# Altium project LowPowerDataLogger.PrjPcb
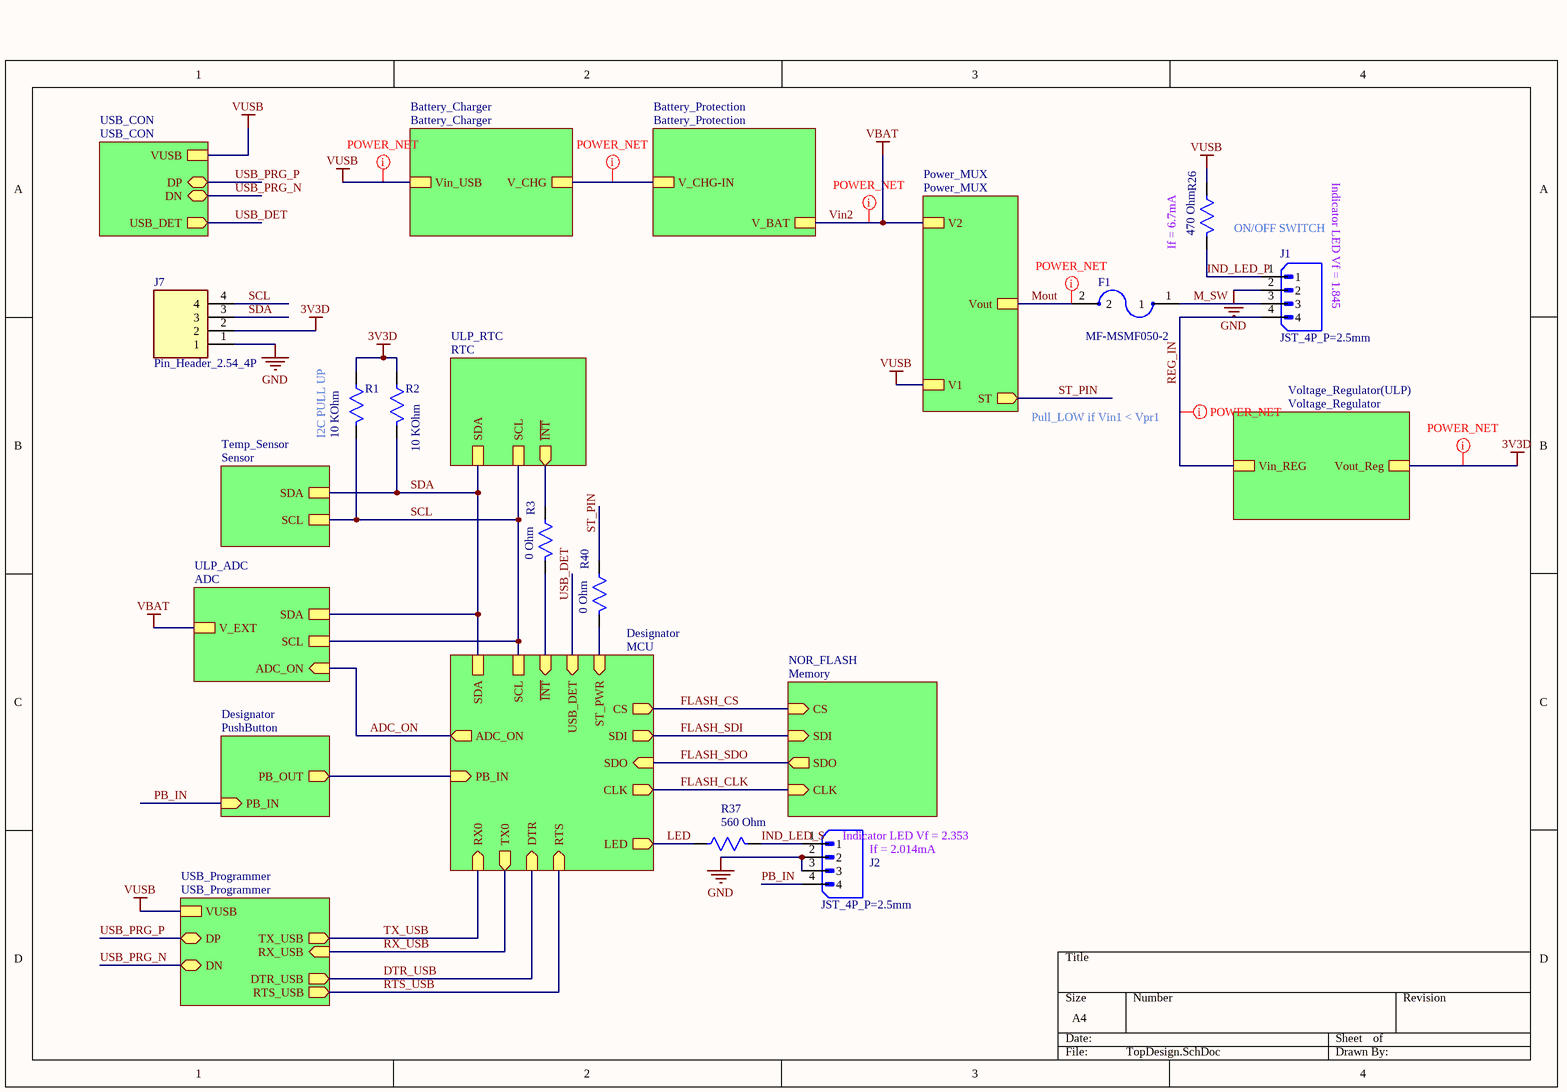
[diagram p0: TopDesign.SchDoc]
13 sheets, 117 parts. Net scope: hierarchical (ports join the sheet entries above them; power ports are global).
Board files: Logger_PCB_6.PcbDoc, Logger_PCB.PcbDoc, Logger_PCB_1.PcbDoc, Logger_PCB_2.PcbDoc, Hole_Cut.PcbDoc
Sheets:
  TopDesign.SchDoc
    Designator = MCU.SchDoc
    Temp_Sensor = Sensor.SchDoc
    ULP_RTC = RTC.SchDoc
    ULP_ADC = ADC.SchDoc
    Designator = PushButton.SchDoc
    NOR_FLASH = Memory.SchDoc
    Battery_Protection = Battery_Protection.SchDoc
    Battery_Charger = Battery_Charger.SchDoc
    Power_MUX = Power_MUX.SchDoc
    Voltage_Regulator(ULP) = Voltage_Regulator.SchDoc
    USB_CON = USB_CON.SchDoc
    USB_Programmer = USB_Programmer.SchDoc

## Sheet TopDesign.SchDoc
size A4; SheetNumber: 1; SheetTotal: 13

### Parts
F1  MF-MSMF050-2  [Fuse_SMD_1812_1A]
J1  JST_4P_P=2.5mm  [JST_4P_Straight_P=2.5mm]
J2  JST_4P_P=2.5mm  [JST_4P_Straight_P=2.5mm]
J7  Pin_Header_2.54_4P  [Pin_Header_2.54_4P]
R1  10 KOhm  [Res_0603]
R2  10 KOhm  [Res_0603]
R3  0 Ohm  [RES_0402]
R26  470 Ohm  [Res_0603]
R37  560 Ohm  [Res_0603]
R40  0 Ohm  [RES_0402]

### Sub-sheets
Battery_Charger = Battery_Charger: Vin_USB, V_CHG
Battery_Protection = Battery_Protection: V_BAT, V_CHG-IN
Designator = MCU: SDA, SCL, PB_IN (in), CS (out), SDI (out), SDO (in), CLK (out), USB_DET (in), ST_PWR (in), TX0 (out), RX0 (in), DTR (in), RTS (in), LED (out), ADC_ON (out), ~{INT} (in)
Designator = PushButton: PB_OUT (out), PB_IN (in)
NOR_FLASH = Memory: CS (in), SDI (in), SDO (out), CLK (in)
Power_MUX = Power_MUX: V2, V1, Vout, ST (out)
Temp_Sensor = Sensor: SDA, SCL
ULP_ADC = ADC: V_EXT, SDA, SCL, ADC_ON (in)
ULP_RTC = RTC: SDA, SCL, ~{INT} (out)
USB_CON = USB_CON: DP (bidir), DN (bidir), USB_DET (out), VUSB
USB_Programmer = USB_Programmer: TX_USB (out), RX_USB (in), DTR_USB (out), DP (bidir), DN (bidir), RTS_USB (out), VUSB
Voltage_Regulator(ULP) = Voltage_Regulator: Vin_REG, Vout_Reg

### Nets
3V3D: J7.2 R1.2 R2.2 ; sheet Voltage_Regulator(ULP)/Vout_Reg
GND: J1.2 J2.2 J2.3 J7.1
Vin2: sheet ULP_ADC/V_EXT, sheet Battery_Protection/V_BAT, sheet Battery_Protection/V_CHG-IN, sheet Battery_Charger/V_CHG, sheet Power_MUX/V2  [also labelled VBAT]
VUSB: R26.2 ; sheet Battery_Charger/Vin_USB, sheet Power_MUX/V1, sheet USB_CON/VUSB, sheet USB_Programmer/VUSB  [project net VBUS]
ADC_ON: sheet Designator/ADC_ON, sheet ULP_ADC/ADC_ON
BTN: sheet Designator/PB_IN, sheet Designator/PB_OUT
DTR_USB: sheet Designator/DTR, sheet USB_Programmer/DTR_USB
FLASH_CLK: sheet Designator/CLK, sheet NOR_FLASH/CLK  [project net CLK]
FLASH_CS: sheet Designator/CS, sheet NOR_FLASH/CS  [project net CS]
FLASH_SDI: sheet Designator/SDI, sheet NOR_FLASH/SDI
FLASH_SDO: sheet Designator/SDO, sheet NOR_FLASH/SDO
IND_LED_P: J1.1 R26.1
IND_LED_S: J2.1 R37.1
LED: R37.2 ; sheet Designator/LED
M_SW: F1.1 J1.3
Mout: F1.2 ; sheet Power_MUX/Vout
PB_IN: J2.4 ; sheet Designator/PB_IN
~{RTC_INT}: R3.1 ; sheet Designator/~{INT}
REG_IN: J1.4 ; sheet Voltage_Regulator(ULP)/Vin_REG
RTC_INT: R3.2 ; sheet ULP_RTC/~{INT}
RTS_USB: sheet Designator/RTS, sheet USB_Programmer/RTS_USB
RX_USB: sheet Designator/TX0, sheet USB_Programmer/RX_USB
SCL: J7.4 R1.1 ; sheet Designator/SCL, sheet Temp_Sensor/SCL, sheet ULP_RTC/SCL, sheet ULP_ADC/SCL
SDA: J7.3 R2.1 ; sheet Designator/SDA, sheet Temp_Sensor/SDA, sheet ULP_RTC/SDA, sheet ULP_ADC/SDA
ST_PIN: R40.2 ; sheet Power_MUX/ST
ST_PWR: R40.1 ; sheet Designator/ST_PWR
TX_USB: sheet Designator/RX0, sheet USB_Programmer/TX_USB
USB_DET: sheet Designator/USB_DET, sheet USB_CON/USB_DET
USB_PRG_N: sheet USB_CON/DN, sheet USB_Programmer/DN
USB_PRG_P: sheet USB_CON/DP, sheet USB_Programmer/DP

### Layout directives
net class POWER_NET: 3V3D, Mout, REG_IN, VBUS, Vin2

### Notes on the sheet
- ON/OFF SWITCH
- (near J1) Indicator LED Vf = 1.845
- (near R26) If = 6.7mA
- (near R1) I2C PULL UP
- Pull_LOW if Vin1 < Vpr1
- (near J2) Indicator LED Vf = 2.353
- (near J2) If = 2.014mA

### Library data of the parts
F1 = MF-MSMF050-2: Polymeric PTC Resettable Fuse 15V 500 mA Ih Surface Mount 1812 (4532 Metric), Concave; MF: Bourns; MP: MF-MSMF050-2; Availability: In Stock; Check_prices: https://www.snapeda.com/parts/MF-MSMF050-2/Bourns+-+J.W.+Miller/view-part/?ref=eda; Price: None; Package: 1812 Bourns; Purchase-URL: https://pricing.snapeda.com/search/part/MF-MSMF050-2/?ref=eda; Value: *; SnapEDA_Link: https://www.snapeda.com/parts/MF-MSMF050-2/Bourns+-+J.W.+Miller/view-part/?ref=snap
J1 J2 = JST_4P_P=2.5mm: Connector Header Through Hole 4 position 0.098 (2.50mm); MF: JST Sales; MP: B4B-XH-A(LF)(SN); SnapEDA_Link: https://www.snapeda.com/parts/B4B-XH-A(LF)(SN)/JST+Sales+America+Inc./view-part/?ref=snap; Package: None; Value: *; Check_prices: https://www.snapeda.com/parts/B4B-XH-A(LF)(SN)/JST+Sales+America+Inc./view-part/?ref=eda
J7 = Pin_Header_2.54_4P: Pin_Header_2.54_2P X 4 MF: 22-28-4050; Manufacturer_Name: Molex; Datasheet Link: http://www.mouser.com/ds/2/276/0022284050_PCB_HEADERS-228092.pdf; Height: 8.38mm; Manufacturer_Part_Number: 22-28-4050; Mouser Part Number: 538-22-28-4050; Mouser Price/Stock: https://www.mouser.co.uk/ProductDetail/Molex/22-28-4050?qs=MuwpYaHj752E1%2FBLq%2Fipmg%3D%3D
R1-R3 R26 R37 R40 = Res smd: SMD Resistor; MP: RC0805FR-07330RL; MF: Yageo; Package: 2012 Rohm Semiconductor; Value: *; SnapEDA_Link: https://www.snapeda.com/parts/RC0805FR-07330RL/Yageo/view-part/106115/?ref=snap; Price: None; Availability: Unavailable

## Sheet MCU.SchDoc
size A4; SheetNumber: 2; SheetTotal: 13
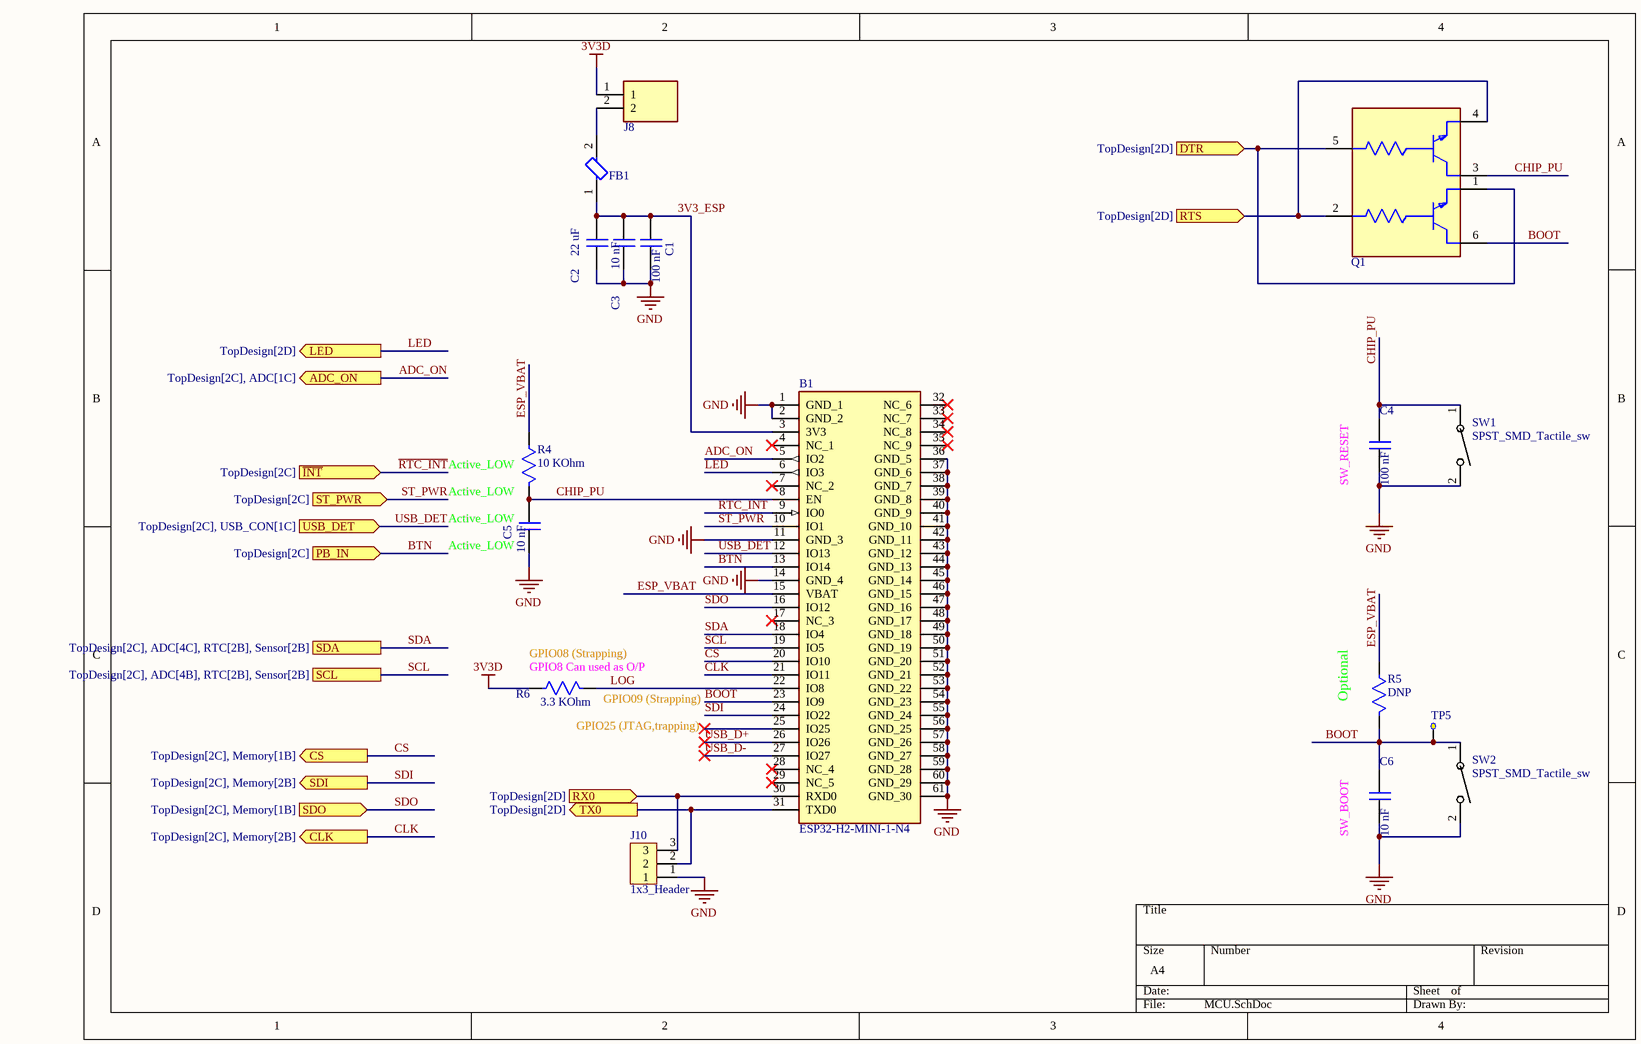
[diagram p1: MCU.SchDoc]

### Parts
B1  ESP32-H2-MINI-1-N4  [ESP32-H2-MINI-1-NX]
C1  100 nF  [CAP_0603]
C2  22 uF  [CAP_0603]
C3  10 nF  [CAP_0603]
C4  100 nF  [CAP_0603]
C5  10 nF  [CAP_0603]
C6  10 nF  [CAP_0603]
FB1  BLM18KG601SN1D  [FBead_Murata_BLM18KG601SN1D]  (value not drawn)
J8  Pin_Header_2.54_2P  [Pin_Header_2.54_2P]  (value not drawn)
J10  1x3_Header  [1x3_Header]
Q1  UMH3NTN-(Dual Transistor With Base Res)  [UMH3NTN-(Dual Transistor With Base Res-SOT-363)]  (value not drawn)
R4  10 KOhm  [Res_0603]
R5  DNP  [Res_0603]
R6  3.3 KOhm  [Res_0603]
SW1  SPST_SMD_Tactile_sw  [SPST_SMD_6mm]
SW2  SPST_SMD_Tactile_sw  [SPST_SMD_6mm]
TP5  boot  [Test_Point]  (value not drawn)

### Ports
ADC_ON (out, see TopDesign[2C], ADC[1C]), CLK (out, see TopDesign[2C], Memory[2B]), CS (out, see TopDesign[2C], Memory[1B]), DTR (in, see TopDesign[2D]), LED (out, see TopDesign[2D]), PB_IN (in, see TopDesign[2C]), RTS (in, see TopDesign[2D]), RX0 (in, see TopDesign[2D]), SCL (see TopDesign[2C], ADC[4B], RTC[2B], Sensor[2B]), SDA (see TopDesign[2C], ADC[4C], RTC[2B], Sensor[2B]), SDI (out, see TopDesign[2C], Memory[2B]), SDO (in, see TopDesign[2C], Memory[1B]), ST_PWR (in, see TopDesign[2C]), TX0 (out, see TopDesign[2D]), USB_DET (in, see TopDesign[2C], USB_CON[1C]), ~{INT} (in, see TopDesign[2C])

### Nets
3V3D: J8.1 R6.2
GND: B1.1(GND_1) B1.2(GND_2) B1.11(GND_3) B1.14(GND_4) B1.36(GND_5) B1.37(GND_6) B1.38(GND_7) B1.39(GND_8) B1.40(GND_9) B1.41(GND_10) B1.42(GND_11) B1.43(GND_12) B1.44(GND_13) B1.45(GND_14) B1.46(GND_15) B1.47(GND_16) B1.48(GND_17) B1.49(GND_18) B1.50(GND_19) B1.51(GND_20) B1.52(GND_21) B1.53(GND_22) B1.54(GND_23) B1.55(GND_24) B1.56(GND_25) B1.57(GND_26) B1.58(GND_27) B1.59(GND_28) B1.60(GND_29) B1.61(GND_30) C1.1 C2.1 C3.1 C4.1 C5.1 C6.1 J10.1 SW1.2 SW2.2
3V3_ESP: B1.3(3V3) C1.2 C2.2 C3.2 FB1.1
ADC_ON: B1.5(IO2) ; port ADC_ON
BOOT: B1.23(IO9) C6.2 Q1.6(C) R5.1 SW2.1 TP5.TP?(Ref_Point)
BTN: B1.13(IO14) ; port PB_IN
CHIP_PU: B1.8(EN) C4.2 C5.2 Q1.3(C) R4.1 SW1.1
CLK: B1.21(IO11) ; port CLK
CS: B1.20(IO10) ; port CS
DTR_USB: Q1.1(E) Q1.5(B) ; port DTR
ESP_VBAT: B1.15(VBAT) R4.2 R5.2
LED: B1.6(IO3) ; port LED
LOG: B1.22(IO8) R6.1
~{RTC_INT}: B1.9(IO0) ; port ~{INT}
RTS_USB: Q1.2(B) Q1.4(E) ; port RTS
RX_USB: B1.31(TXD0) J10.2 ; port TX0
SCL: B1.19(IO5) ; port SCL
SDA: B1.18(IO4) ; port SDA
SDI: B1.24(IO22) ; port SDI  [project net FLASH_SDI]
SDO: B1.16(IO12) ; port SDO  [project net FLASH_SDO]
ST_PWR: B1.10(IO1) ; port ST_PWR
TX_USB: B1.30(RXD0) J10.3 ; port RX0
USB_D+: B1.26(IO26)
USB_D-: B1.27(IO27)
USB_DET: B1.12(IO13) ; port USB_DET
NetFB1_2: FB1.2 J8.2

Not connected (* = marked no-connect by the designer): B1 4(NC_1)* 7(NC_2)* 17(NC_3)* 25(IO25)* 28(NC_4)* 29(NC_5)* 32(NC_6)* 33(NC_7)* 34(NC_8)* 35(NC_9)*

### Notes on the sheet
- Active_LOW
- (near R4) Active_LOW
- (near C4) SW_RESET
- (near C5) Active_LOW
- (near R6) GPIO08 (Strapping)
- (near R6) GPIO8 Can used as O/P
- (near R6) GPIO25 (JTAG,trapping)
- (near R6) GPIO09 (Strapping)
- (near R5) Optional
- (near C6) SW_BOOT

### Library data of the parts
B1 = ESP32-H2-MINI-1-XX: Multiprotocol Modules ENGINEERING SAMPLE Bluetooth Low Energy and IEEE 802.15.4  module with ESP32-H2 chip; Manufacturer_Name: Espressif Systems; Geometry.Height: 2.55mm; Manufacturer_Part_Number: ESP32-H2-MINI-1-N4; Datasheet Link: https://www.espressif.com/sites/default/files/documentation/esp32-h2-mini-1_mini-1u_datasheet_en.pdf; LCSC: N-C18203134/U-C22470215
C1-C6 = Cap SMD: Cap SMD.
J8 = Pin_Header_2.54_2P: Pin_Header_2.54_2P_Straight; Manufacturer_Name: Wurth Elektronik; Manufacturer_Part_Number: 61300211121; Geometry.Height: 8.54mm; Datasheet Link: https://componentsearchengine.com/Datasheets/2/61300211121.pdf; LCSC: C492401
Q1 = UMH3NTN-(Dual Transistor With Base Res): UMH3NTN-(Dual Transistor With Base Res = 4.7K) , 100@1mA,5V 150mW 100mA 50V SOT-363 Digital Transistors ROHS; MPN: ROHM; MFPN: UMH3NTN; Datasheet: https://www.lcsc.com/datasheet/C123008.pdf; LCSC: C123008
R4-R6 = Res smd: as R1 on sheet TopDesign; Package: 2012 Rohm Semiconductor; Value: *; SnapEDA_Link: https://www.snapeda.com/parts/RC0805FR-07330RL/Yageo/view-part/106115/?ref=snap; Price: None; Availability: Unavailable
SW1 SW2 = SPST_SMD_Tactile_sw: SPST SMD Tactile Switches Rectangle button Brick nogging; Mfr_Name: XKB Connectivity
TP5 = Test_Point

## Sheet Sensor.SchDoc
size A4; SheetNumber: 6; SheetTotal: 14
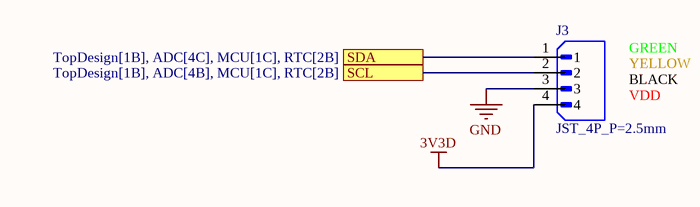
[diagram p2: Sensor.SchDoc]

### Parts
J3  JST_4P_P=2.5mm  [JST_4P_Straight_P=2.5mm]

### Ports
SCL (see TopDesign[1B], ADC[4B], MCU[1C], RTC[2B]), SDA (see TopDesign[1B], ADC[4C], MCU[1C], RTC[2B])

### Nets
3V3D: J3.4
GND: J3.3
SCL: J3.2 ; port SCL
SDA: J3.1 ; port SDA

### Notes on the sheet
- GREEN
- YELLOW
- BLACK
- VDD

### Library data of the parts
J3 = JST_4P_P=2.5mm: as J1 on sheet TopDesign; SnapEDA_Link: https://www.snapeda.com/parts/B4B-XH-A(LF)(SN)/JST+Sales+America+Inc./view-part/?ref=snap; Package: None; Value: *; Check_prices: https://www.snapeda.com/parts/B4B-XH-A(LF)(SN)/JST+Sales+America+Inc./view-part/?ref=eda

## Sheet RTC.SchDoc
size A4; SheetNumber: 8; SheetTotal: 13
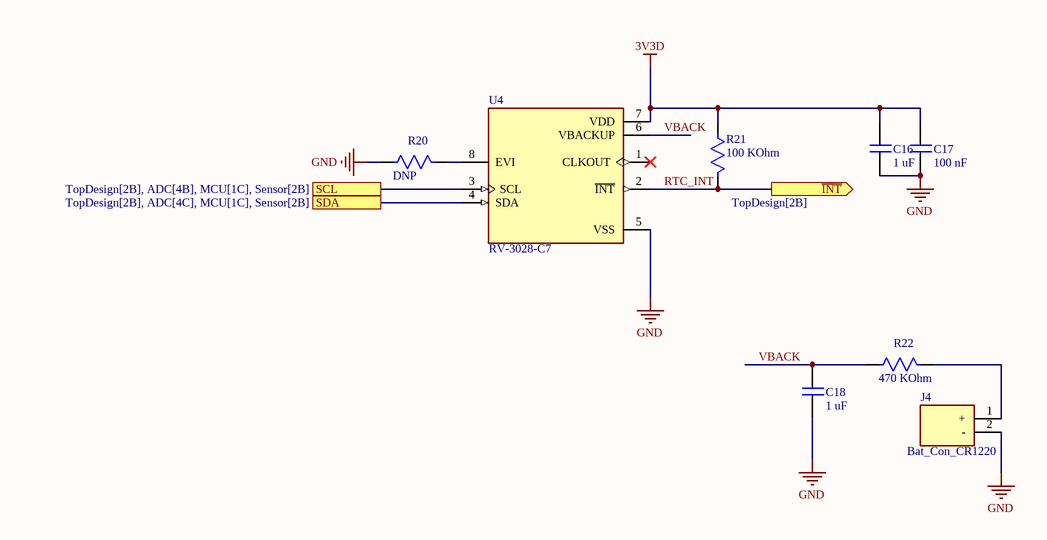
[diagram p3: RTC.SchDoc]

### Parts
C16  1 uF  [CAP_0603]
C17  100 nF  [CAP_0603]
C18  1 uF  [CAP_0603]
J4  Bat_Con_CR1220  [Bat_Con_CR1220]
R20  DNP  [RES_0402]
R21  100 KOhm  [Res_0603]
R22  470 KOhm  [Res_0603]
U4  RV-3028-C7  [IC_RV-3028-C7]

### Ports
SCL (see TopDesign[2B], ADC[4B], MCU[1C], Sensor[2B]), SDA (see TopDesign[2B], ADC[4C], MCU[1C], Sensor[2B]), ~{INT} (out, see TopDesign[2B])

### Nets
3V3D: C16.2 C17.2 R21.2 U4.7(VDD)
GND: C16.1 C17.1 C18.1 J4.2(-) R20.2 U4.5(VSS)
RTC_INT: R21.1 U4.2(~{INT}) ; port ~{INT}
SCL: U4.3(SCL) ; port SCL
SDA: U4.4(SDA) ; port SDA
VBACK: C18.2 R22.2 U4.6(VBACKUP)
NetJ4_1: J4.1(+) R22.1
NetR20_1: R20.1 U4.8(EVI)

Not connected (* = marked no-connect by the designer): U4 1(CLKOUT)*

### Library data of the parts
C16-C18 = Cap SMD: Cap SMD.
J4 = Bat_Con_CR1220: Connector; Manufacturer_Name: Harwin; Manufacturer_Part_Number: S8411-45R; Datasheet Link: https://cdn.harwin.com/pdfs/S8411R.pdf; Mouser Part Number: 855-S8411-45R; Mouser Price/Stock: https://www.mouser.co.uk/ProductDetail/Harwin/S8411-45R?qs=Qom7kyPojXY6B0JhnWxDgQ%3D%3D; LCSC: C969906
R20-R22 = Res smd: as R1 on sheet TopDesign; Package: 2012 Rohm Semiconductor; Value: *; SnapEDA_Link: https://www.snapeda.com/parts/RC0805FR-07330RL/Yageo/view-part/106115/?ref=snap; Price: None; Availability: Unavailable
U4 = RV-3028-C7: Real Time Clock (RTC) IC Clock/Calendar 2B, 43B IÂ²C, 2-Wire Serial 8-WCDFN; MF: Micro Crystal; MFPN: RV-3028-C7 32.768KHZ 1PPM-TA-QA; SnapEDA_Link: https://www.snapeda.com/parts/RV-3028-C7%2032.768KHZ%201PPM-TA-QA/Micro+Crystal/view-part/?ref=snap; Package: SMD3215-8P; LCSC: C3304278

## Sheet ADC.SchDoc
size A4; SheetNumber: 5; SheetTotal: 14
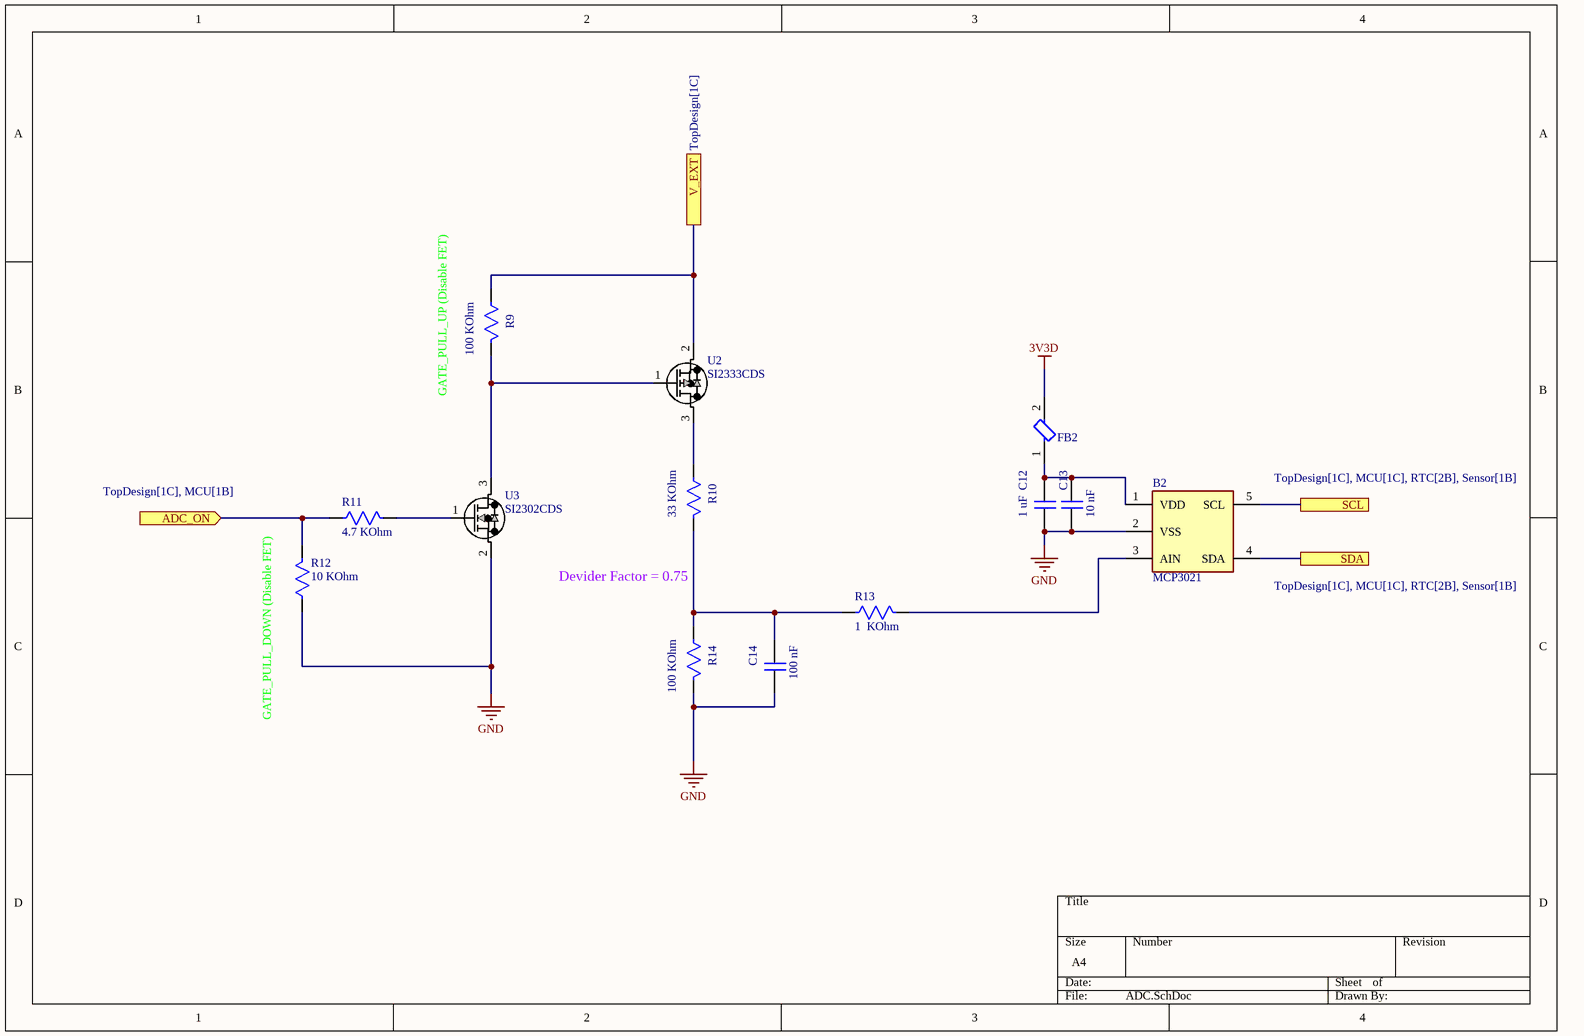
[diagram p4: ADC.SchDoc]

### Parts
B2  MCP3021  [MCP3021A5T-E_OT]
C12  1 uF  [CAP_0603]
C13  10 nF  [CAP_0603]
C14  100 nF  [CAP_0603]
FB2  BLM18KG601SN1D  [FBead_Murata_BLM18KG601SN1D]  (value not drawn)
R9  100 KOhm  [Res_0603]
R10  33 KOhm  [Res_0603]
R11  4.7 KOhm  [Res_0603]
R12  10 KOhm  [Res_0603]
R13  1  KOhm  [Res_0603]
R14  100 KOhm  [Res_0603]
U2  SI2333CDS  [SOT-23]
U3  SI2302CDS  [SOT-23]

### Ports
ADC_ON (in, see TopDesign[1C], MCU[1B]), SCL (see TopDesign[1C], MCU[1C], RTC[2B], Sensor[1B]), SDA (see TopDesign[1C], MCU[1C], RTC[2B], Sensor[1B]), V_EXT (see TopDesign[1C])

### Nets
3V3D: FB2.2
GND: B2.2(VSS) C12.1 C13.1 C14.1 R12.2 R14.1 U3.2(S)
Vin2: R9.2 U2.2(S) ; port V_EXT
ADC_ON: R11.2 R12.1 ; port ADC_ON
SCL: B2.5(SCL) ; port SCL
SDA: B2.4(SDA) ; port SDA
NetB2_1: B2.1(VDD) C12.2 C13.2 FB2.1
NetB2_3: B2.3(AIN) R13.1
NetC14_2: C14.2 R10.1 R13.2 R14.2
NetR9_1: R9.1 U2.1(G) U3.3(D)
NetR10_2: R10.2 U2.3(D)
NetR11_1: R11.1 U3.1(G)

### Notes on the sheet
- (near R9) GATE_PULL_UP (Disable FET)
- Devider Factor = 0.75
- (near R12) GATE_PULL_DOWN (Disable FET)

### Library data of the parts
B2 = MCP3021A5T-E_OT: ADC - ,SAR, Single Ended ,10-bit ,I2C , 250uA-Active ,1uA -Standby; Manufacturer_Name: Microchip; Manufacturer_Part_Number: MCP3021A5T-E/OT; Geometry.Height: 1.45mm; Foot Print: SOT-23-5; Datasheet Link: https://lcsc.componentsearchengine.com/Datasheets/2/MCP3021A5T-E_OT.pdf; LCSC: C128576
C12-C14 = Cap SMD: Cap SMD.
R9-R14 = Res smd: as R1 on sheet TopDesign; Package: 2012 Rohm Semiconductor; Value: *; SnapEDA_Link: https://www.snapeda.com/parts/RC0805FR-07330RL/Yageo/view-part/106115/?ref=snap; Price: None; Availability: Unavailable
U2 = SI2333CDS: P-Channel  MOSFET Vds=12V ,RDS(on)=35mOhm .  at VGS = 4.5 V; Mfr_Name: Vishay; Type: P-MOSFET; LCSC: C48179
U3 = SI2302CDS: N-Channel  MOSFET Vds=20V ,RDS(on)=57mOhm .  at VGS = 4.5 V; Mfr_Name: Vishay; Type: N-MOSFET; LCSC: C10488

## Sheet PushButton.SchDoc
size A4; SheetNumber: 3; SheetTotal: 14
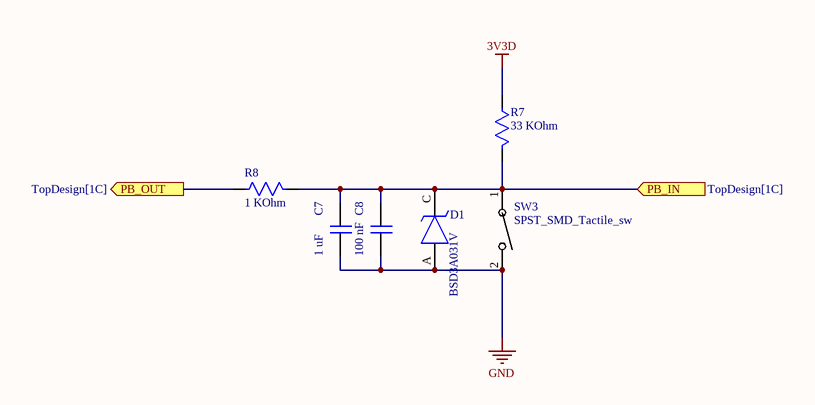
[diagram p5: PushButton.SchDoc]

### Parts
C7  1 uF  [CAP_0603]
C8  100 nF  [CAP_0603]
D1  BSD3A031V  [MCC_SOD-323_IPC_A]
R7  33 KOhm  [Res_0603]
R8  1 KOhm  [Res_0603]
SW3  SPST_SMD_Tactile_sw  [SPST_SMD_6mm]

### Ports
PB_IN (in, see TopDesign[1C]), PB_OUT (out, see TopDesign[1C])

### Nets
3V3D: R7.2
GND: C7.1 C8.1 D1.A SW3.2
BTN: R8.2 ; port PB_OUT
PB_IN: C7.2 C8.2 D1.C R7.1 R8.1 SW3.1 ; port PB_IN

### Library data of the parts
C7 C8 = Cap SMD: Cap SMD.
D1 = TVS_Diode_Single: TVS Diode (Uni-directional); Manufacturer_Name: LITTELFUSE; Manufacturer_Part_Number: SMAJ14A; Datasheet Link: https://componentsearchengine.com/Datasheets/2/SMAJ14A.pdf; Height: 2.29mm; Mouser Part Number: 576-SMAJ14A; Mouser Price/Stock: https://www.mouser.co.uk/ProductDetail/Littelfuse/SMAJ14A?qs=HR2RnyOI4E4Xmn1pka9YNw%3D%3D; Arrow Part Number: SMAJ14A; Arrow Price/Stock: https://www.arrow.com/en/products/smaj14a/littelfuse?region=nac
R7 R8 = Res smd: as R1 on sheet TopDesign; Package: 2012 Rohm Semiconductor; Value: *; SnapEDA_Link: https://www.snapeda.com/parts/RC0805FR-07330RL/Yageo/view-part/106115/?ref=snap; Price: None; Availability: Unavailable
SW3 = SPST_SMD_Tactile_sw: as SW1 on sheet MCU

## Sheet Memory.SchDoc
size A4; SheetNumber: 7; SheetTotal: 13
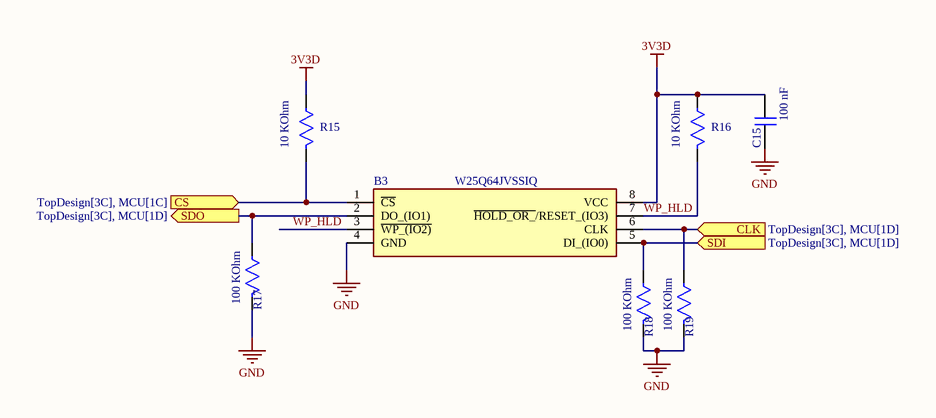
[diagram p6: Memory.SchDoc]

### Parts
B3  W25Q64JVSSIQ  [W25Q64JVSSIQ]
C15  100 nF  [CAP_0603]
R15  10 KOhm  [Res_0603]
R16  10 KOhm  [Res_0603]
R17  100 KOhm  [Res_0603]
R18  100 KOhm  [Res_0603]
R19  100 KOhm  [Res_0603]

### Ports
CLK (in, see TopDesign[3C], MCU[1D]), CS (in, see TopDesign[3C], MCU[1C]), SDI (in, see TopDesign[3C], MCU[1D]), SDO (out, see TopDesign[3C], MCU[1D])

### Nets
3V3D: B3.8(VCC) C15.2 R15.2 R16.2
GND: B3.4(GND) C15.1 R17.1 R18.1 R19.1
CLK: B3.6(CLK) R19.2 ; port CLK
CS: B3.1(~{CS}) R15.1 ; port CS
FLASH_SDI: B3.5(DI_(IO0)) R18.2 ; port SDI
FLASH_SDO: B3.2(DO_(IO1)) R17.2 ; port SDO
WP_HLD: B3.3(~{WP_(IO2)}) B3.7(~{HOLD_OR_}/RESET_(IO3)) R16.1

### Library data of the parts
B3 = W25Q64JVSSIQ: 64Mb Serial NOR Flash 133MHz SOP864Mbit 2.7V~3.6V 133MHz SPI SOIC-8-208mil Memory (ICs) ROHS; Manufacturer_Name: Winbond; Geometry.Height: 2.16mm; Manufacturer_Part_Number: W25Q64JVSSIQ; Datasheet Link: https://www.winbond.com/hq/search-resource-file.jsp?partNo=W25Q64JVSSIQ&type=datasheet; LCSC: C179171
C15 = Cap SMD: Cap SMD.
R15-R19 = Res smd: as R1 on sheet TopDesign; Package: 2012 Rohm Semiconductor; Value: *; SnapEDA_Link: https://www.snapeda.com/parts/RC0805FR-07330RL/Yageo/view-part/106115/?ref=snap; Price: None; Availability: Unavailable

## Sheet Battery_Protection.SchDoc
size A4; SheetNumber: 11; SheetTotal: 13
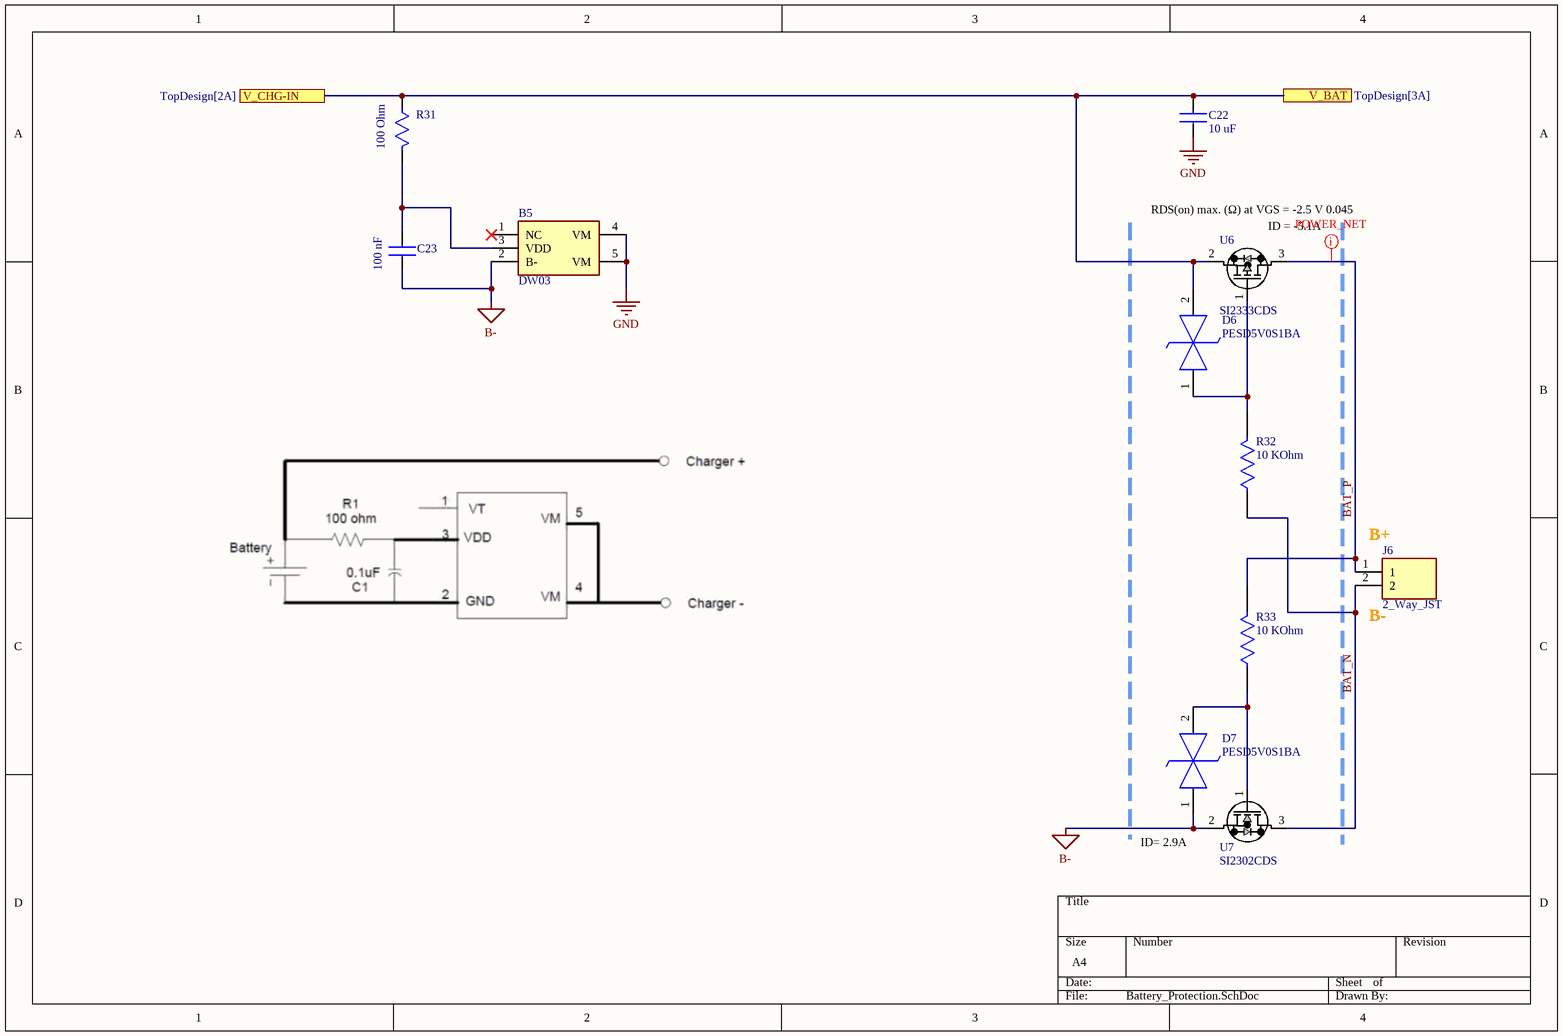
[diagram p7: Battery_Protection.SchDoc]

### Parts
B5  DW03  [DW03]
C22  10 uF  [CAP_0603]
C23  100 nF  [CAP_0603]
D6  PESD5V0S1BA  [TVS_SOD-323]
D7  PESD5V0S1BA  [TVS_SOD-323]
J6  2_Way_JST  [2_Way_JST_Connector]
R31  100 Ohm  [Res_0603]
R32  10 KOhm  [Res_0603]
R33  10 KOhm  [Res_0603]
U6  SI2333CDS  [SOT-23]
U7  SI2302CDS  [SOT-23]

### Ports
V_BAT (see TopDesign[3A]), V_CHG-IN (see TopDesign[2A])

### Nets
B-: B5.2(B-) C23.1 D7.1(K1) U7.2(S)
GND: B5.4(VM) B5.5(VM) C22.1
Vin2: C22.2 D6.2(K2) R31.2 U6.2(S) ; port V_BAT, port V_CHG-IN
BAT_N: J6.2 R32.1 U7.3(D)
BAT_P: J6.1 R33.2 U6.3(D)
NetB5_3: B5.3(VDD) C23.2 R31.1
NetD6_1: D6.1(K1) R32.2 U6.1(G)
NetD7_2: D7.2(K2) R33.1 U7.1(G)

Not connected (* = marked no-connect by the designer): B5 1(NC)*

### Layout directives
mark named POWER_NET: BAT_P

### Notes on the sheet
- (near U6) RDS(on) max. (Ω) at VGS = -2.5 V 0.045
- (near U6) ID = -5.1A
- (near J6) B+
- (near J6) B-
- (near U7) ID= 2.9A

### Library data of the parts
B5 = DW03: 2K 256X8 1.8V Ser.EEPROM,24AA02E48T-I/OT; Manufacturer_Name: HXY MOSFET; Geometry.Height: 1.45mm; Manufacturer_Part_Number: DW03; Datasheet Link: https://www.lcsc.com/datasheet/C18198382.pdf; LCSC: C18198382
C22 C23 = Cap_SMD_New: Cap Ceramic 1uF 10V X5R 10% Pad SMD 0402 85C T/R; Manufacturer_Name: SAMSUNG; Manufacturer_Part_Number: CL05A105KP5NNNC; Geometry.Height: 0.55mm; Mouser Part Number: 187-CL05A105KP5NNNC; Mouser Price/Stock: https://www.mouser.co.uk/ProductDetail/Samsung-Electro-Mechanics/CL05A105KP5NNNC?qs=X6jEic%2FHinBsUeNeR9HD7w%3D%3D; Arrow Part Number: CL05A105KP5NNNC; Arrow Price/Stock: https://www.arrow.com/en/products/cl05a105kp5nnnc/samsung-electro-mechanics?region=nac; Datasheet Link: https://www.arrow.com/en/products/cl05a105kp5nnnc/samsung-electro-mechanics
D6 D7 = TVS_Diode_Bi-Direcctional: Diode ESD (Bi-directional); Manufacturer_Name: Nexperia; Manufacturer_Part_Number: PESD12VL1BA,115; Datasheet Link: https://assets.nexperia.com/documents/data-sheet/PESDXL1BA_SER.pdf; Height: 1.1mm; Mouser Part Number: 771-PESD12VL1BA-T/R; Mouser Price/Stock: https://www.mouser.co.uk/ProductDetail/Nexperia/PESD12VL1BA115?qs=LOCUfHb8d9tizc9iojOZUw%3D%3D; Arrow Part Number: PESD12VL1BA,115; Arrow Price/Stock: https://www.arrow.com/en/products/pesd12vl1ba115/nexperia?region=europe
J6 = 2_Way_JST_Connector: Connector Header Through Hole 2 position 0.098 (2.50mm); MF: JST Sales; MP: B2B-XH-A(LF)(SN); Value: *; Check_prices: https://www.snapeda.com/parts/B2B-XH-A(LF)(SN)/JST%20Sales%20America%20Inc./view-part/492310/?ref=eda; Price: None; Package: None; Availability: In Stock; SnapEDA_Link: https://www.snapeda.com/parts/B2B-XH-A(LF)(SN)/JST%20Sales%20America%20Inc./view-part/492310/?ref=snap
R31-R33 = Res smd: as R1 on sheet TopDesign; Package: 2012 Rohm Semiconductor; Value: *; SnapEDA_Link: https://www.snapeda.com/parts/RC0805FR-07330RL/Yageo/view-part/106115/?ref=snap; Price: None; Availability: Unavailable
U6 = SI2333CDS: as U2 on sheet ADC; Type: P-MOSFET; LCSC: C48179
U7 = SI2302CDS: as U3 on sheet ADC; Type: N-MOSFET; LCSC: C10488

## Sheet Battery_Charger.SchDoc
size A4; SheetNumber: 10; SheetTotal: 13
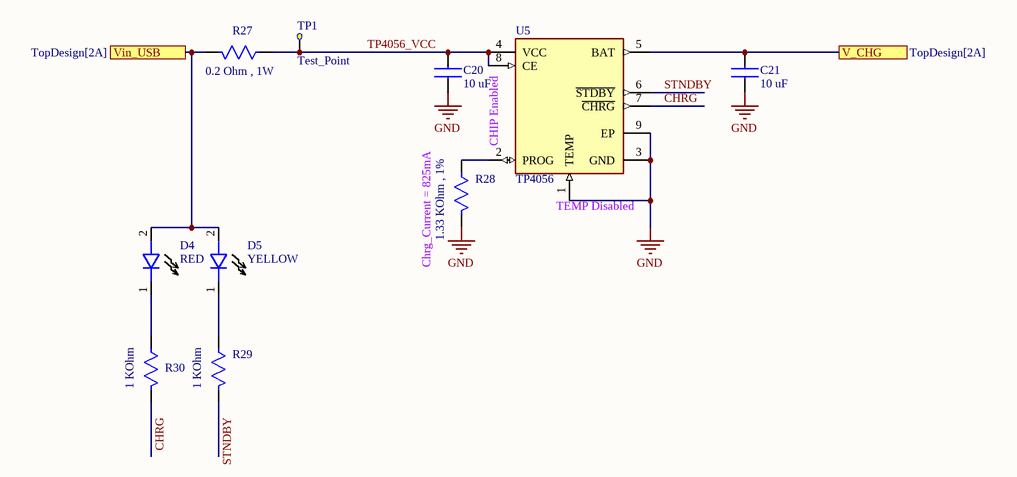
[diagram p8: Battery_Charger.SchDoc]

### Parts
C20  10 uF  [CAP_0603]
C21  10 uF  [CAP_0603]
D4  RED  [LED SMD 0603]
D5  YELLOW  [LED SMD 0603]
R27  0.2 Ohm , 1W  [RES_2512]
R28  1.33 KOhm , 1%  [Res_0603]
R29  1 KOhm  [Res_0603]
R30  1 KOhm  [Res_0603]
TP1  Test_Point  [Test_Point]
U5  TP4056  [TP4056-SOP-8-EP]

### Ports
V_CHG (see TopDesign[2A]), Vin_USB (see TopDesign[2A])

### Nets
GND: C20.1 C21.1 R28.1 U5.1(TEMP) U5.3(GND) U5.9(EP)
VBUS: D4.2 D5.2 R27.1 ; port Vin_USB
Vin2: C21.2 U5.5(BAT) ; port V_CHG
CHRG: R30.1 U5.7(~{CHRG})
STNDBY: R29.1 U5.6(~{STDBY})
TP4056_VCC: C20.2 R27.2 TP1.TP?(Ref_Point) U5.4(VCC) U5.8(CE)
NetD4_1: D4.1 R30.2
NetD5_1: D5.1 R29.2
NetR28_2: R28.2 U5.2(PROG)

### Notes on the sheet
- (near U5) CHIP Enabled
- (near U5) TEMP Disabled
- (near R28) Chrg_Current = 825mA

### Library data of the parts
C20 C21 = Cap_SMD_New: as C22 on sheet Battery_Protection; Mouser Part Number: 187-CL05A105KP5NNNC; Mouser Price/Stock: https://www.mouser.co.uk/ProductDetail/Samsung-Electro-Mechanics/CL05A105KP5NNNC?qs=X6jEic%2FHinBsUeNeR9HD7w%3D%3D; Arrow Part Number: CL05A105KP5NNNC; Arrow Price/Stock: https://www.arrow.com/en/products/cl05a105kp5nnnc/samsung-electro-mechanics?region=nac; Datasheet Link: https://www.arrow.com/en/products/cl05a105kp5nnnc/samsung-electro-mechanics
D4 D5 = LED SMD: SMD LED
R27-R30 = Res smd: as R1 on sheet TopDesign; Package: 2012 Rohm Semiconductor; Value: *; SnapEDA_Link: https://www.snapeda.com/parts/RC0805FR-07330RL/Yageo/view-part/106115/?ref=snap; Price: None; Availability: Unavailable
U5 = TP4056: Complete single cell Li-Ion battery with a constant current / constant voltage linear charger(SOP 8); MFPN: TP4056; Datasheet: https://dlnmh9ip6v2uc.cloudfront.net/datasheets/Prototyping/TP4056.pdf; LCSC: C7473158

## Sheet Power_MUX.SchDoc
size A4; SheetNumber: 12; SheetTotal: 13
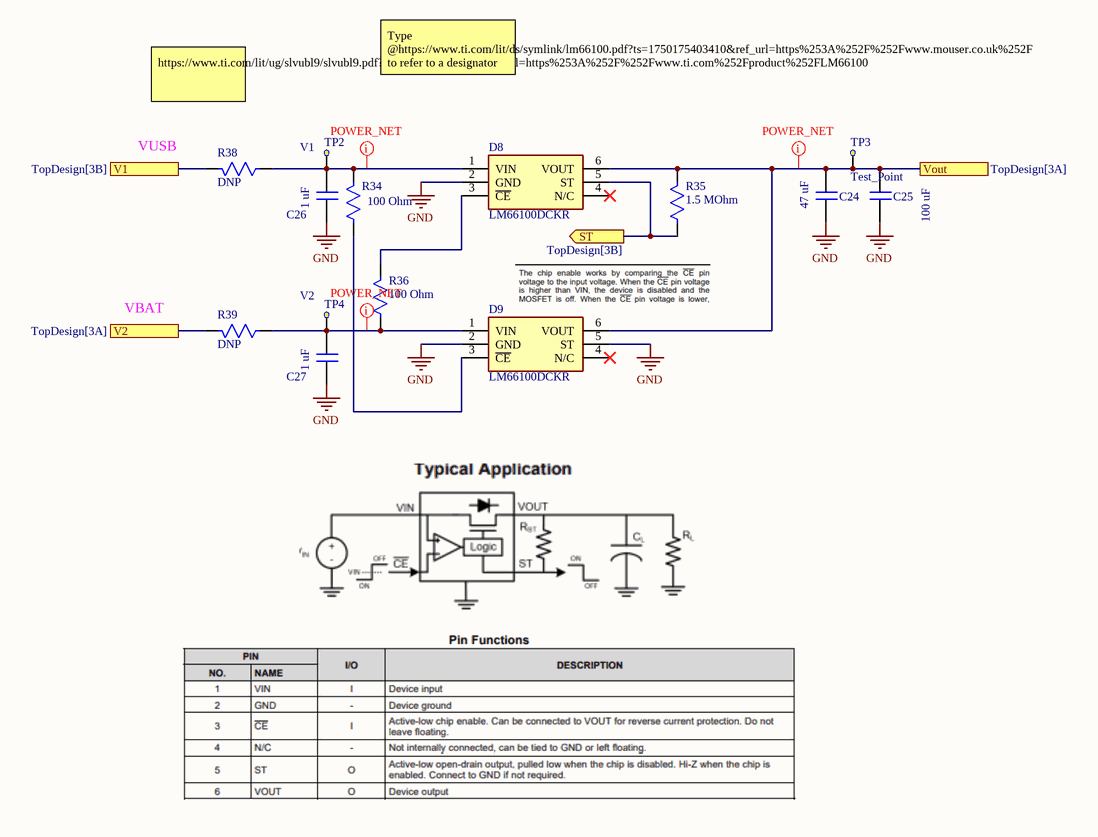
[diagram p9: Power_MUX.SchDoc]

### Parts
C24  47 uF  [CAP SMD 1206]
C25  100 uF  [CAP SMD 1206]
C26  1 uF  [CAP_0603]
C27  1 uF  [CAP_0603]
D8  LM66100DCKR  [LM66100DCKR]
D9  LM66100DCKR  [LM66100DCKR]
R34  100 Ohm  [Res_0603]
R35  1.5 MOhm  [Res_0603]
R36  100 Ohm  [Res_0603]
R38  DNP  [RES_0402]
R39  DNP  [RES_0402]
TP2  V1  [Test_Point]
TP3  Test_Point  [Test_Point]
TP4  V2  [Test_Point]

### Ports
ST (out, see TopDesign[3B]), V1 (see TopDesign[3B]), V2 (see TopDesign[3A]), Vout (see TopDesign[3A])

### Nets
GND: C24.1 C25.1 C26.1 C27.1 D8.2(GND) D9.2(GND) D9.5(ST)
VBUS: R38.1 ; port V1
Vin2: R39.1 ; port V2
Mout: C24.2 C25.2 D8.6(VOUT) D9.6(VOUT) R35.1 TP3.TP?(Ref_Point) ; port Vout
ST_PIN: D8.5(ST) R35.2 ; port ST
NetC26_2: C26.2 D8.1(VIN) R34.1 R38.2 TP2.TP?(Ref_Point)
NetC27_2: C27.2 D9.1(VIN) R36.2 R39.2 TP4.TP?(Ref_Point)
NetD8_3: D8.3(~{CE}) R36.1
NetD9_3: D9.3(~{CE}) R34.2

Not connected (* = marked no-connect by the designer): D8 4(N/C)*; D9 4(N/C)*

### Layout directives
mark named POWER_NET: Mout, NetC26_2, NetC27_2

### Notes on the sheet
- https://www.ti.com/lit/ug/slvubl9/slvubl9.pdf?ts=1750260250038&ref_url=https%253A%252F%252Fwww.ti.com%252Fproduct%252FLM66100
- Type @https://www.ti.com/lit/ds/symlink/lm66100.pdf?ts=1750175403410&ref_url=https%253A%252F%252Fwww.mouser.co.uk%252F to refer to a designator or a net
- (near R38) VUSB
- VBAT

### Library data of the parts
C24-C27 = Cap SMD: Cap SMD.
D8 D9 = LM66100DCKR: +/-6-V, Low IQ ideal diode with input polarity protection; Manufacturer_Name: Texas Instruments; Geometry.Height: 1.1mm; Manufacturer_Part_Number: LM66100DCKR; Datasheet Link: http://www.ti.com/lit/gpn/LM66100; LCSC: C2869734; FootPrint: SC-70-6
R34-R36 R38 R39 = Res smd: as R1 on sheet TopDesign; Package: 2012 Rohm Semiconductor; Value: *; SnapEDA_Link: https://www.snapeda.com/parts/RC0805FR-07330RL/Yageo/view-part/106115/?ref=snap; Price: None; Availability: Unavailable
TP2 TP4 = Test_Point

## Sheet Voltage_Regulator.SchDoc
size A4; SheetNumber: 14; SheetTotal: 14
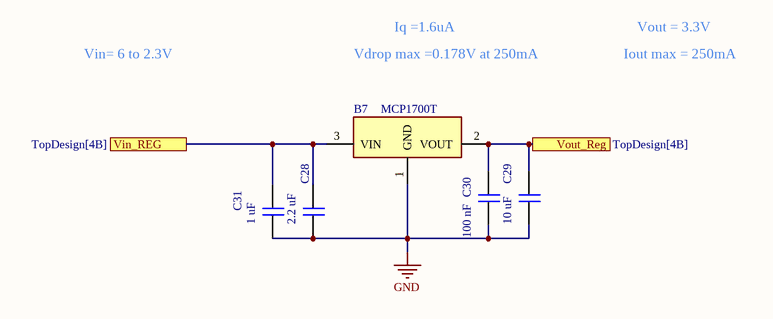
[diagram p10: Voltage_Regulator.SchDoc]

### Parts
B7  MCP1700T  [MCP1700T-SOT23]
C28  2.2 uF  [CAP_0603]
C29  10 uF  [CAP_0603]
C30  100 nF  [CAP_0603]
C31  1 uF  [CAP_0603]

### Ports
Vin_REG (see TopDesign[4B]), Vout_Reg (see TopDesign[4B])

### Nets
3V3D: B7.2(VOUT) C29.2 C30.2 ; port Vout_Reg
GND: B7.1(GND) C28.1 C29.1 C30.1 C31.1
REG_IN: B7.3(VIN) C28.2 C31.2 ; port Vin_REG

### Notes on the sheet
- Vin= 6 to 2.3V
- Vdrop max =0.178V at 250mA
- Iq =1.6uA
- Iout max = 250mA
- Vout = 3.3V

### Library data of the parts
B7 = MCP1700T-SOT23: LDO voltage regulator 250mA Isupply 1.6uA; MPN: Microchip; MFPN: MCP1700T-3302E/TT; Geometry.Height: 1.12mm; Datasheet Link: https://datasheet.datasheetarchive.com/originals/distributors/SFDatasheet-4/sf-00090030.pdf; LCSC: C39051; Iq: 1.6 uA
C28-C31 = Cap SMD: Cap SMD.

## Sheet USB_CON.SchDoc
size A4; SheetNumber: 9; SheetTotal: 13
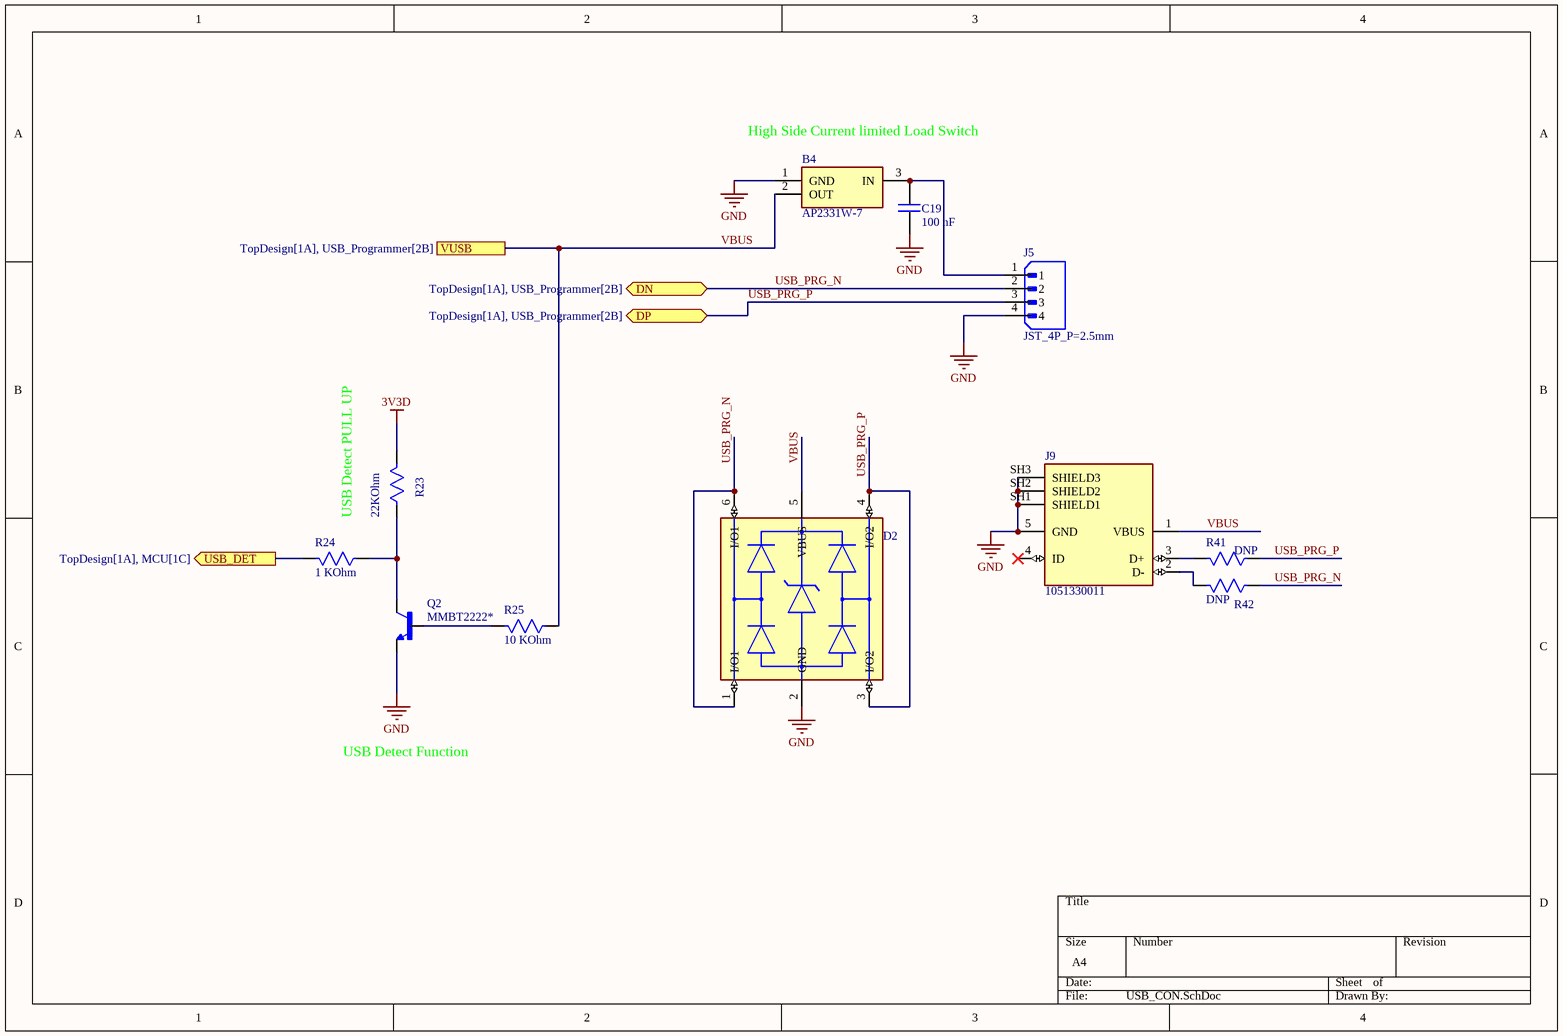
[diagram p11: USB_CON.SchDoc]

### Parts
B4  AP2331W-7  [AP2331W-7-(SOT-23-3)]
C19  100 nF  [CAP_0603]
D2  USBLC6-2SC6  [USBLC6-2SC6]  (value not drawn)
J5  JST_4P_P=2.5mm  [JST_4P_Straight_P=2.5mm]
J9  1051330011  [USB_Micro_B_90_MOLEX_1051330011]
Q2  MMBT2222*  [Bipolar _BJT_ Transistor]
R23  22KOhm  [Res_0603]
R24  1 KOhm  [Res_0603]
R25  10 KOhm  [Res_0603]
R41  DNP  [Res_0603]
R42  DNP  [Res_0603]

### Ports
DN (bidir, see TopDesign[1A], USB_Programmer[2B]), DP (bidir, see TopDesign[1A], USB_Programmer[2B]), USB_DET (out, see TopDesign[1A], MCU[1C]), VUSB (see TopDesign[1A], USB_Programmer[2B])

### Nets
3V3D: R23.1
GND: B4.1(GND) C19.2 D2.2(GND) J5.4 J9.5(GND) J9.SH1(SHIELD1) J9.SH2(SHIELD2) J9.SH3(SHIELD3) Q2.E
VBUS: B4.2(OUT) D2.5(VBUS) J9.1(VBUS) R25.2 ; port VUSB
USB_DET: R24.1 ; port USB_DET
USB_PRG_N: D2.1(I/O1) D2.6(I/O1) J5.2 R42.2 ; port DN
USB_PRG_P: D2.3(I/O2) D2.4(I/O2) J5.3 R41.2 ; port DP
NetB4_3: B4.3(IN) C19.1 J5.1
NetJ9_2: J9.2(D-) R42.1
NetJ9_3: J9.3(D+) R41.1
NetQ2_B: Q2.B R25.1
NetQ2_C: Q2.C R23.2 R24.2

Not connected (* = marked no-connect by the designer): J9 4(ID)*

### Notes on the sheet
- High Side Current limited Load Switch
- USB Detect PULL UP
- USB Detect Function

### Library data of the parts
B4 = AP2331W-7: High Side Current limited Load Switch 2.7V~5.2V 250mΩ 200mA; Manufacturer_Name: Diodes Incorporated; Geometry.Height: 1.3mm; Manufacturer_Part_Number: AP2331W-7; Datasheet Link: https://www.diodes.com//assets/Datasheets/AP2331.pdf; Package: SC-59 , SOT-23; LCSC: SC-59 : C460346 , SOT23 :  C500764
C19 = Cap SMD: Cap SMD.
D2 = USBLC6-2SC6: 5A 17V 6V Unidirectional 5.25V SOT-23-6L ESD and Surge Protection (TVS/ESD) ROHS , 2 data-line USB 2.0 protection, Protects VBUS, capacitance: 3.5 pF; MPN: ST Micro Electronics; MFPN: USBLC6-2SC6; Package: SOT-23-6L; Datasheet: https://www.st.com/resource/en/datasheet/usblc6-2.pdf; Application: USB 2.0 , Data & Power Protection; LCSC: C7519
J5 = JST_4P_P=2.5mm: as J1 on sheet TopDesign; SnapEDA_Link: https://www.snapeda.com/parts/B4B-XH-A(LF)(SN)/JST+Sales+America+Inc./view-part/?ref=snap; Package: None; Value: *; Check_prices: https://www.snapeda.com/parts/B4B-XH-A(LF)(SN)/JST+Sales+America+Inc./view-part/?ref=eda
J9 = 1051330011: USB - micro B USB 2.0 Receptacle Connector 5 Position Surface Mount; MF: Molex; SnapEDA_Link: https://www.snapeda.com/parts/1051330011/Molex/view-part/?ref=snap; Package: None; Value: *; MP: 1051330011; Check_prices: https://www.snapeda.com/parts/1051330011/Molex/view-part/?ref=eda
Q2 = MMBT2222*: Bipolar _BJT_ Transistor NPN 30V 600mA 250MHz 350mW Surface Mount SOT-23-3; MF: ON Semiconductor; Package: SOT-23-3 Fairchild Semiconductor; Value: *; Price: None; MP: MMBT2222; Availability: Unavailable; SnapEDA_Link: https://www.snapeda.com/parts/MMBT2222/ON%20Semiconductor/view-part/214298/?ref=snap
R23-R25 R41 R42 = Res smd: as R1 on sheet TopDesign; Package: 2012 Rohm Semiconductor; Value: *; SnapEDA_Link: https://www.snapeda.com/parts/RC0805FR-07330RL/Yageo/view-part/106115/?ref=snap; Price: None; Availability: Unavailable

## Sheet USB_Programmer.SchDoc
size A4; SheetNumber: 4; SheetTotal: 13
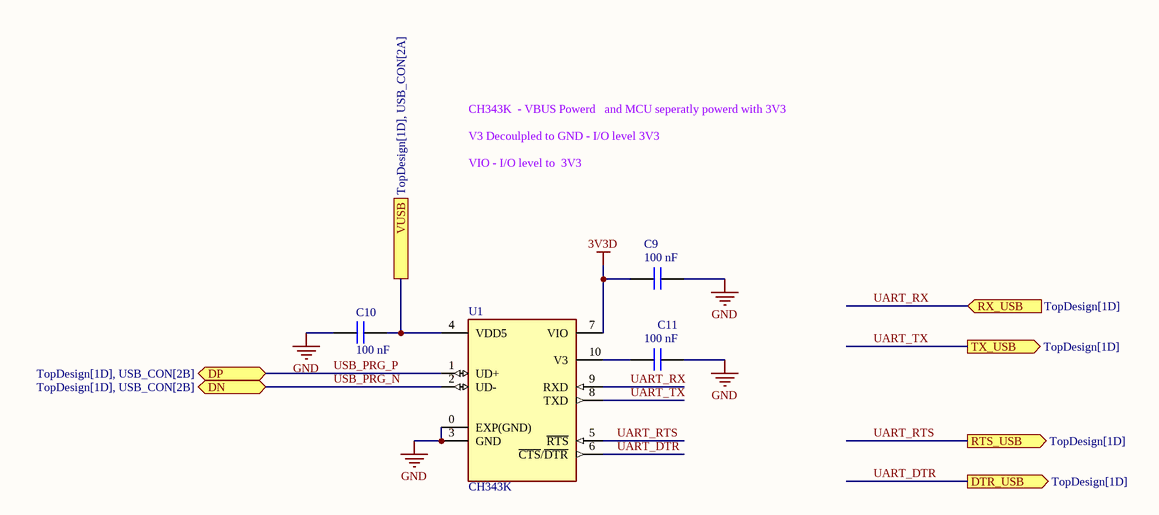
[diagram p12: USB_Programmer.SchDoc]

### Parts
C9  100 nF  [CAP_0603]
C10  100 nF  [CAP_0603]
C11  100 nF  [CAP_0603]
U1  CH343K  [CH343K]

### Ports
DN (bidir, see TopDesign[1D], USB_CON[2B]), DP (bidir, see TopDesign[1D], USB_CON[2B]), DTR_USB (out, see TopDesign[1D]), RTS_USB (out, see TopDesign[1D]), RX_USB (in, see TopDesign[1D]), TX_USB (out, see TopDesign[1D]), VUSB (see TopDesign[1D], USB_CON[2A])

### Nets
3V3D: C9.2 U1.7(VIO)
GND: C9.1 C10.2 C11.1 U1.0(EXP(GND)) U1.3(GND)
VBUS: C10.1 U1.4(VDD5) ; port VUSB
UART_DTR: U1.6(~{CTS}/~{DTR}) ; port DTR_USB  [project net DTR_USB]
UART_RTS: U1.5(~{RTS}) ; port RTS_USB  [project net RTS_USB]
UART_RX: U1.9(RXD) ; port RX_USB  [project net RX_USB]
UART_TX: U1.8(TXD) ; port TX_USB  [project net TX_USB]
USB_PRG_N: U1.2(UD-) ; port DN
USB_PRG_P: U1.1(UD+) ; port DP
NetC11_2: C11.2 U1.10(V3)

### Notes on the sheet
- CH343K  - VBUS Powerd   and MCU seperatly powerd with 3V3
- V3 Decoulpled to GND - I/O level 3V3
- VIO - I/O level to  3V3

### Library data of the parts
C9-C11 = Cap SMD: Cap SMD.
U1 = CH343K: USB to UART USB 2.0 ESSOP-10-150mil-1mm Interface Controllers ROHS; MF: WCH; Package: ESSOP-10; Datasheet: https://www.lcsc.com/datasheet/C5832295.pdf; MP: CH343K; Check_prices: https://www.lcsc.com/product-detail/C5832295.html?s_z=n_CH343; LCSC: C5832295

## Nets that join several sheets
3V3D: TopDesign (J7.2 R1.2 R2.2), MCU (J8.1 R6.2), Sensor (J3.4), RTC (C16.2 C17.2 R21.2 U4.7), ADC (FB2.2), PushButton (R7.2), Memory (B3.8 C15.2 R15.2 R16.2), Voltage_Regulator (B7.2 C29.2 C30.2), USB_CON (R23.1), USB_Programmer (C9.2 U1.7)
GND: TopDesign (J1.2 J2.2 J2.3 J7.1), MCU (39 pins), Sensor (J3.3), RTC (6 pins), ADC (7 pins), PushButton (C7.1 C8.1 D1.A SW3.2), Memory (5 pins), Battery_Protection (B5.4 B5.5 C22.1), Battery_Charger (6 pins), Power_MUX (7 pins), Voltage_Regulator (5 pins), USB_CON (9 pins), USB_Programmer (5 pins)
VBUS: TopDesign (R26.2), Battery_Charger (D4.2 D5.2 R27.1), Power_MUX (R38.1), USB_CON (B4.2 D2.5 J9.1 R25.2), USB_Programmer (C10.1 U1.4)
Vin2: ADC (R9.2 U2.2), Battery_Protection (C22.2 D6.2 R31.2 U6.2), Battery_Charger (C21.2 U5.5), Power_MUX (R39.1)
ADC_ON: MCU (B1.5), ADC (R11.2 R12.1)
BTN: MCU (B1.13), PushButton (R8.2)
CLK: MCU (B1.21), Memory (B3.6 R19.2)
CS: MCU (B1.20), Memory (B3.1 R15.1)
DTR_USB: MCU (Q1.1 Q1.5), USB_Programmer (U1.6)
FLASH_SDI: MCU (B1.24), Memory (B3.5 R18.2)
FLASH_SDO: MCU (B1.16), Memory (B3.2 R17.2)
LED: TopDesign (R37.2), MCU (B1.6)
Mout: TopDesign (F1.2), Power_MUX (6 pins)
PB_IN: TopDesign (J2.4), PushButton (6 pins)
~{RTC_INT}: TopDesign (R3.1), MCU (B1.9)
REG_IN: TopDesign (J1.4), Voltage_Regulator (B7.3 C28.2 C31.2)
RTC_INT: TopDesign (R3.2), RTC (R21.1 U4.2)
RTS_USB: MCU (Q1.2 Q1.4), USB_Programmer (U1.5)
RX_USB: MCU (B1.31 J10.2), USB_Programmer (U1.9)
SCL: TopDesign (J7.4 R1.1), MCU (B1.19), Sensor (J3.2), RTC (U4.3), ADC (B2.5)
SDA: TopDesign (J7.3 R2.1), MCU (B1.18), Sensor (J3.1), RTC (U4.4), ADC (B2.4)
ST_PIN: TopDesign (R40.2), Power_MUX (D8.5 R35.2)
ST_PWR: TopDesign (R40.1), MCU (B1.10)
TX_USB: MCU (B1.30 J10.3), USB_Programmer (U1.8)
USB_DET: MCU (B1.12), USB_CON (R24.1)
USB_PRG_N: USB_CON (D2.1 D2.6 J5.2 R42.2), USB_Programmer (U1.2)
USB_PRG_P: USB_CON (D2.3 D2.4 J5.3 R41.2), USB_Programmer (U1.1)